# Altium schematic sheet USB.SchDoc
size A4; SheetNumber: 3; SheetTotal: 4
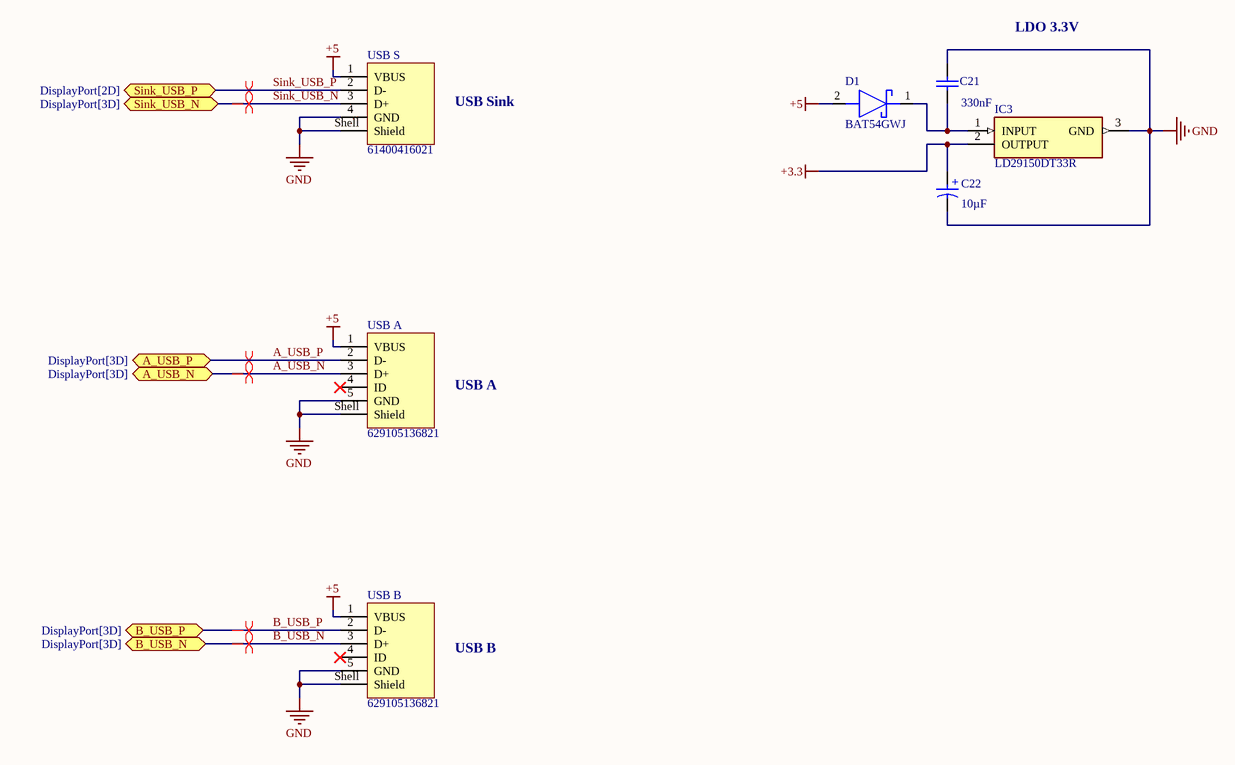
[diagram p0: USB.SchDoc]

## Parts
C21  Capacitance: 330nF  [WCAP-CSGP_0603_L1.6W0.8H0.8_Reflow]  (hidden comment: 885012206023)
C22  Capacitance: 10µF  [WCAP-ASLI_D4H5.5]  (hidden comment: 865080340001)
D1  BAT54GWJ  [SOD123]
IC3  LD29150DT33R  [ST_DPAK_1]
USB_A  629105136821  [629105136821]
USB_B  629105136821  [629105136821]
USB_S  61400416021  [61400416021]

## Ports
A_USB_N (bidir, see DisplayPort[3D]), A_USB_P (bidir, see DisplayPort[3D]), B_USB_N (bidir, see DisplayPort[3D]), B_USB_P (bidir, see DisplayPort[3D]), Sink_USB_N (bidir, see DisplayPort[3D]), Sink_USB_P (bidir, see DisplayPort[2D])

## Nets
+3.3: C22.1(P) IC3.2(OUTPUT)
+5: D1.2(A) USB_A.1(VBUS) USB_B.1(VBUS) USB_S.1(VBUS)
GND: C21.2 C22.2(N) IC3.3(GND) USB_A.5(GND) USB_A.Shell(Shield) USB_B.5(GND) USB_B.Shell(Shield) USB_S.4(GND) USB_S.Shell(Shield)
A_USB_N: USB_A.3(D+) ; port A_USB_N
A_USB_P: USB_A.2(D-) ; port A_USB_P
B_USB_N: USB_B.3(D+) ; port B_USB_N
B_USB_P: USB_B.2(D-) ; port B_USB_P
Sink_USB_N: USB_S.3(D+) ; port Sink_USB_N
Sink_USB_P: USB_S.2(D-) ; port Sink_USB_P
NetC21_1: C21.1 D1.1(K) IC3.1(INPUT)

Not connected (* = marked no-connect by the designer): USB_A 4(ID)*; USB_B 4(ID)*

## Layout directives
differential pair; differential pair class USB_Sink: Sink_USB_N, Sink_USB_P
differential pair; differential pair class USB_A: A_USB_N, A_USB_P
differential pair; differential pair class USB_B: B_USB_N, B_USB_P

## Notes on the sheet
- LDO 3.3V
- USB Sink
- USB A
- USB B
- (in symbol CMP-03913-53914566-1) +

## Library data of the parts
C21 = CMP-03913-53914732-1: 885012206023 Ceramic Capacitor 330nF, 10VDC, 0603, ±10 %; Voltage Rating: 10V; Tolerance: 10%; Insulation Resistance: 1.5GΩ; Dielectric: X7R; Packaging: Tape & Reel (TR); Case Code (Metric): 1608; Length: 1.6mm; Height: 800µm; Thickness: 939.8µm; Voltage Rating (DC): 10V; NexarPartId: 53914732; Min Operating Temperature: -55°C; Mount: Surface Mount; Case Code (Imperial): 0603; Width: 800µm; Case/Package: 0603; Max Operating Temperature: 125°C; RoHS: Compliant
C22 = CMP-03913-53914566-1: 865080340001 WCAP-ASLI Aluminum Electrolytic Capacitors; Impedance: 2.2Ω; ESR (Equivalent Series Resistance): 1.66693Ω; Life (Hours): 2000hours; Ripple Current (AC): 80mA; Voltage Rating (DC): 16V; Polarity: Polar; Leakage Current: 3µA; Insulation Resistance: 5.33333MΩ; Tolerance: 20%; Case/Package: Radial; Min Operating Temperature: -55°C; Height: 5.5mm; Lead Free: Lead Free; Packaging: Tape & Reel (TR); REACH SVHC: Unknown; Length: 5.5mm; Height - Seated (Max): 5.5118mm; Max Operating Temperature: 105°C; NexarPartId: 53914566; Diameter: 4mm; Ripple Current: 80mA; Mount: Surface Mount; RoHS: Compliant; Voltage Rating: 16V; Width: 4.3mm
D1 = BAT54GWJ: Schottky Diode; Manufacturer_Name: Nexperia; Datasheet Link: https://assets.nexperia.com/documents/data-sheet/BAT54GW.pdf; Manufacturer_Part_Number: BAT54GWJ; Mouser Part Number: 841-BAT54GWJ; Mouser Price/Stock: https://www.mouser.co.uk/ProductDetail/Nexperia/BAT54GWJ?qs=EO%252B2iqeaG03qzVr9l4ml1Q%3D%3D; Arrow Part Number: BAT54GWJ; Arrow Price/Stock: https://www.arrow.com/en/products/bat54gwj/nexperia?region=europe
IC3 = LD29150DT33R: Integrated Circuit; Manufacturer_Name: STMicroelectronics; Datasheet Link: http://www.st.com/web/en/resource/technical/document/datasheet/CD00003403.pdf; Manufacturer_Part_Number: LD29150DT33R; Mouser Part Number: 511-LD29150DT33R; Mouser Price/Stock: https://www.mouser.co.uk/ProductDetail/STMicroelectronics/LD29150DT33R?qs=M4RLcaOHglr1iYLz8rxZ4g%3D%3D; Arrow Part Number: LD29150DT33R; Arrow Price/Stock: https://www.arrow.com/en/products/ld29150dt33r/stmicroelectronics?region=nac
USB_A USB_B = CMP-1502-03253-2: NexarPartId: 19991173; Insulation Resistance: 1GΩ; Contact Resistance: 30mΩ; Number of Contacts: 5; Number of Ports: 1; Gender: Receptacle; Current Rating: 1A; Connector Type: USB; Voltage Rating: 30V; USB Standard: USB 2.0; Plating: Nickel; Max Operating Temperature: 105°C; Orientation: Horizontal; Height: 2.9mm; Termination: Solder; Min Operating Temperature: -40°C; Number of Pins: 5; Flammability Rating: UL94 V-0; Lead Free: Lead Free; Packaging: Tape and Reel; Contact Plating: Gold; RoHS: Compliant; Mount: Horizontal, Surface Mount; Color: Black; REACH SVHC: Unknown; Operating Supply Voltage: 30V; Contact Material: Copper; Number of Positions: 5; Length: 5.9mm
USB_S = CMP-1502-03227-2: NexarPartId: 21041530; Contact Resistance: 20mΩ; Gender: Receptacle; Voltage Rating (DC): 30V; Current Rating: 1.5A; Connector Type: USB; Insulation Resistance: 1GΩ; USB Standard: USB 2.0; Number of Contacts: 4; Number of Ports: 1; Width: 14.4mm; REACH SVHC: Unknown; Contact Plating: Gold; Length: 15.8mm; Lead Free: Lead Free; Max Operating Temperature: 105°C; Orientation: Horizontal; Contact Material: Copper; Voltage Rating: 30V; Min Operating Temperature: -40°C; Flammability Rating: UL94 V-0; Color: White; RoHS: Compliant; Number of Pins: 4; Mount: Horizontal, Through Hole; Number of Positions: 4; Operating Supply Voltage: 30V; Insulation Material: PBT; Termination: Solder